# Altium schematic sheet DueShield.SchDoc
size 525 x 460 mm
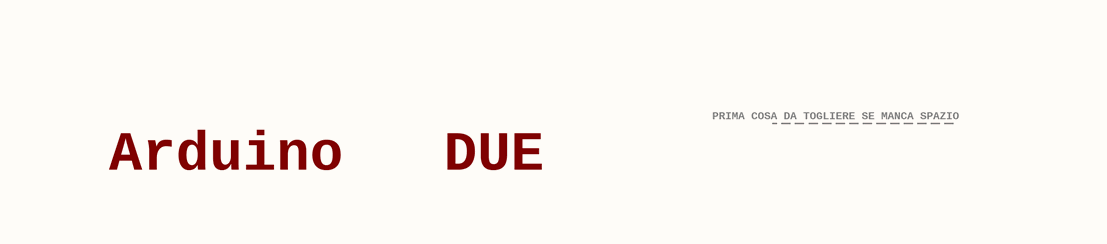
[diagram p0: DueShield.SchDoc, top left]
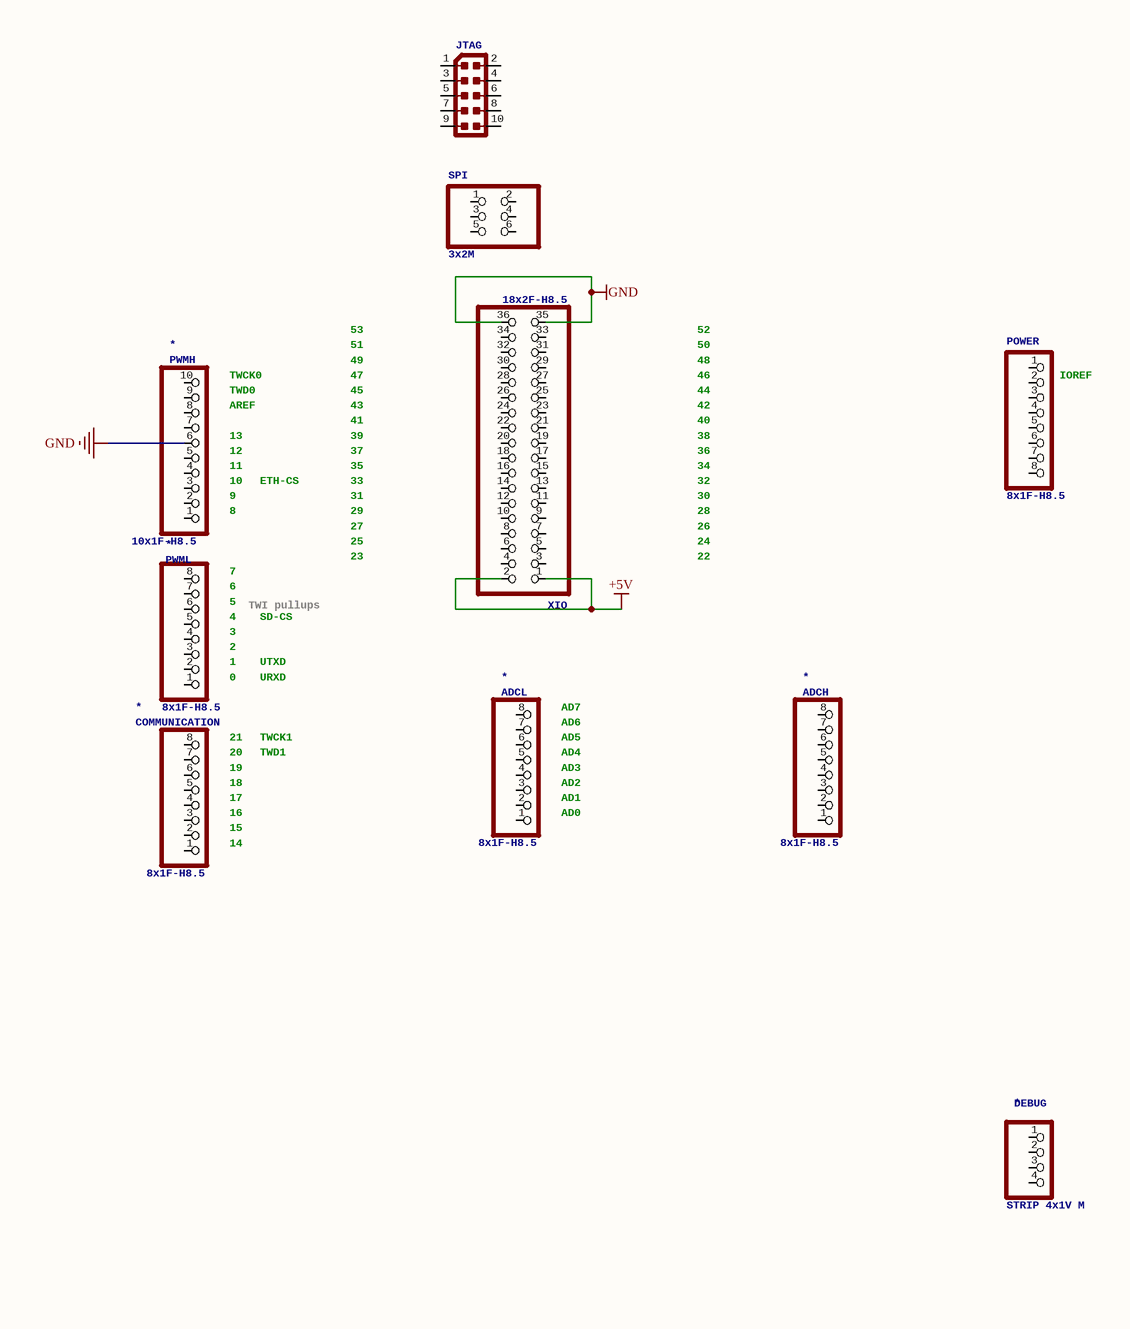
[diagram p1: DueShield.SchDoc, top right]
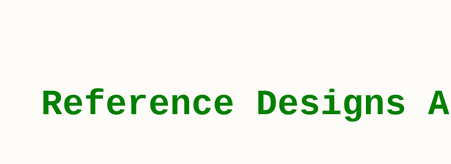
[diagram p2: DueShield.SchDoc, bottom left]
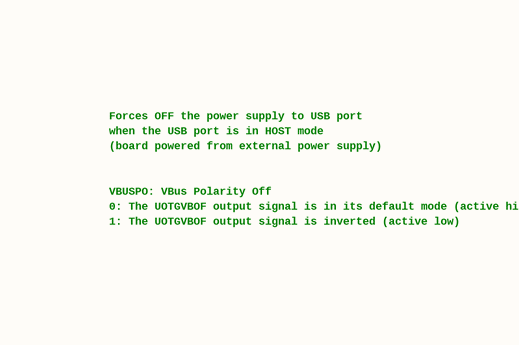
[diagram p3: DueShield.SchDoc, bottom right]

## Parts
ADCH  8x1F-H8.5  [1X08]
ADCL  8x1F-H8.5  [1X08]
COMMUNICATION  8x1F-H8.5  [1X08]
DEBUG  STRIP 4x1V M  [1X04]
JTAG  PINHEAD_PINHD-2X5PASSO127  [PINHEAD_2X05_127]  (value not drawn)
POWER  8x1F-H8.5  [1X08]
PWMH  10x1F-H8.5  [1X10]
PWML  8x1F-H8.5  [1X08]
SPI  3x2M  [2X03]
XIO  18x2F-H8.5  [2X18]

## Nets
+5V: XIO.1 XIO.2
GND: PWMH.6 XIO.35 XIO.36

Not connected (* = marked no-connect by the designer): ADCH 1 2 3 4 5 6 7 8; ADCL 1 2 3 4 5 6 7 8; COMMUNICATION 1 2 3 4 5 6 7 8; DEBUG 1 2 3 4; JTAG 1 2 3 4 5 6 7 8 9 10; POWER 1 2 3 4 5 6 7 8; PWMH 1 2 3 4 5 7 8 9 10; PWML 1 2 3 4 5 6 7 8; SPI 1 2 3 4 5 6; XIO 3 4 5 6 7 8 9 10 11 12 13 14 15 16 17 18 19 20 21 22 23 24 25 26 27 28 29 30 31 32 33 34

## Notes on the sheet
- 53
- 52
- (near PWMH) TWCK0
- (near PWMH) TWD0
- (near PWMH) AREF
- 51
- 49
- 47
- 45
- 43
- 50
- 48
- 46
- 44
- 42
- (near POWER) IOREF
- (near PWMH) 10
- (near PWMH) 11
- (near PWMH) 12
- (near PWMH) 13
- ETH-CS
- 33
- 35
- 37
- 41
- 39
- 32
- 34
- 36
- 40
- 38
- (near PWMH) 8
- (near PWMH) 9
- 23
- 25
- 27
- 29
- 31
- 22
- 24
- 26
- 28
- 30
- (near PWML) 3
- (near PWML) 4
- (near PWML) 5
- (near PWML) 6
- (near PWML) 7
- (near PWML) TWI pullups
- SD-CS
- (near PWML) 0
- (near PWML) 1
- (near PWML) 2
- UTXD
- URXD
- (near ADCL) AD7
- (near COMMUNICATION) 18
- (near COMMUNICATION) 19
- (near COMMUNICATION) 20
- (near COMMUNICATION) 21
- TWCK1
- TWD1
- (near ADCL) AD2
- (near ADCL) AD3
- (near ADCL) AD4
- (near ADCL) AD5
- (near ADCL) AD6
- (near COMMUNICATION) 15
- (near COMMUNICATION) 16
- (near COMMUNICATION) 17
- (near COMMUNICATION) 14
- (near ADCL) AD1
- (near ADCL) AD0
- PRIMA COSA DA TOGLIERE SE MANCA SPAZIO
- Arduino   DUE
- Forces OFF the power supply to USB port
- when the USB port is in HOST mode
- (board powered from external power supply)
- VBUSPO: VBus Polarity Off
- 0: The UOTGVBOF output signal is in its default mode (active high)
- 1: The UOTGVBOF output signal is inverted (active low)
- Reference Designs ARE PROVIDED "AS IS" AND "WITH ALL FAULTS". Arduino DISCLAIMS ALL OTHER WARRANTIES, EXPRESS OR IMPLIED,
  REGARDING PRODUCTS, INCLUDINF BUT NOT LIMITED TO, ANY IMPLIED WARRIENTIS OR MERCHANTABILITY OR FITNESS FOR A PARTICULAR PURPOSE
  Arduino may make changes to specifications and product descriptions at any tie, without notice. The customer must not
  rely on the absence of characteristics of any features or instructions marked "reserved" or "undefined". Arduino reserves
  these for future definition and shall have no responsibility whatsover for conflicts or incompatibilities arising from future changes to them.
  The product information on the Web Site or Materials is subject to change without notice. Do nor finalize a design with this information.
  The ARDUINO logo is a trademark of Arduino LLC registered in the US and in the rest of the world.
  Use of the Arduino name must be compliant with http://www.arduino.cc/en/Main/Policy

## Library data of the parts
ADCH ADCL COMMUNICATION POWER PWML = PINHD-1X8: PIN HEADER
  ADCH ADCL COMMUNICATION PWML: NAME: *
DEBUG = PINHD-1X4: PIN HEADER; NAME: *
JTAG = PINHEAD_PINHD-2X5PASSO127: PIN HEADER
PWMH = PINHD-1X10: PIN HEADER; NAME: *
SPI = PINHD-2X3: PIN HEADER
XIO = PINHD-2X18: PIN HEADER